# EAGLE design tiny13_charlie4_50mm_coincell_optical_diag (EAGLE 6.2)
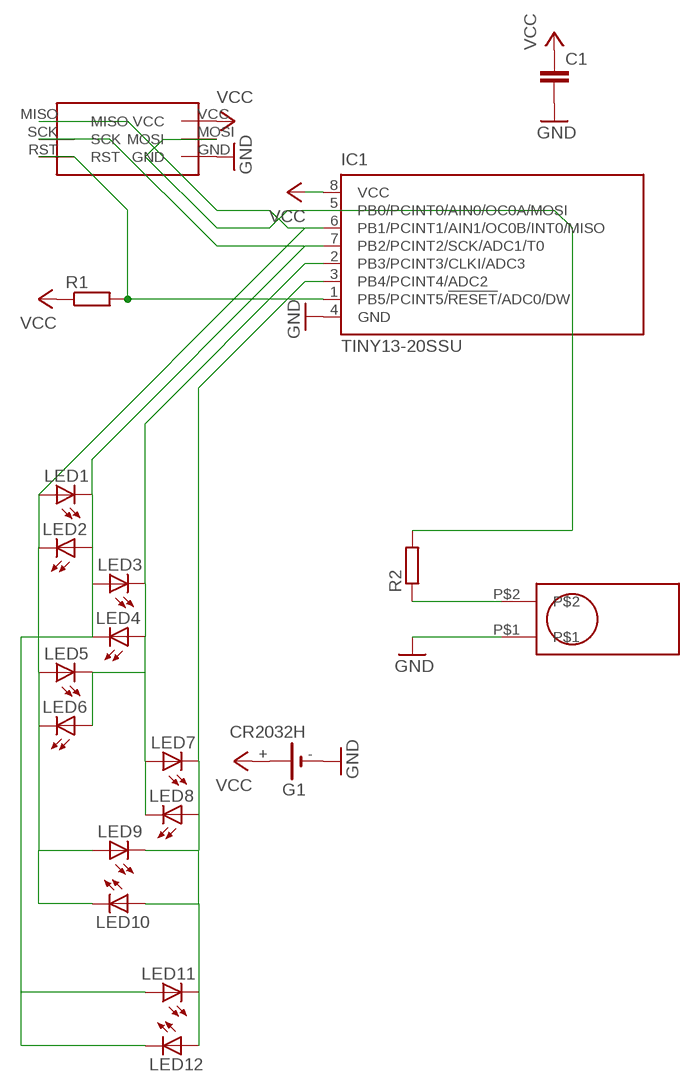
[diagram p0: schematic, sheet 1]

## Parts
C1  C-EU025-025X050  [C025-025X050]
G1  CR2032H  [CR2032H]
IC1  TINY13-20SSU  [8S1]
LED1  LED3MM  [LED3MM]
LED2  LED3MM  [LED3MM]
LED3  LED3MM  [LED3MM]
LED4  LED3MM  [LED3MM]
LED5  LED3MM  [LED3MM]
LED6  LED3MM  [LED3MM]
LED7  LED3MM  [LED3MM]
LED8  LED3MM  [LED3MM]
LED9  LED3MM  [LED3MM]
LED10  LED3MM  [LED3MM]
LED11  LED3MM  [LED3MM]
LED12  LED3MM  [LED3MM]
R1  R-EU_0204/5  [0204/5]
R2  R-EU_0204/5  [0204/5]
U$1  TILT_SWITCH_MECHANICAL  [TILT_SWITCH_MECHANICAL]
U$2  AVR_ISP_6_PIN_1X6_SMT_CONTACT_BIG  [CONTACT_ISP_PROGRAMMER_1X6_ATMEL]

## Nets
GND: C1.2 G1.- IC1.4(GND) U$1.P$1 U$2.GND
N$1: IC1.2(PB3/PCINT3/CLKI/ADC3) LED3.K(C) LED4.A LED5.K(C) LED6.A LED7.A LED8.K(C)
N$2: IC1.7(PB2/PCINT2/SCK/ADC1/T0) LED1.K(C) LED2.A LED3.A LED4.K(C) LED11.A LED12.K(C) U$2.SCK
N$3: R2.1 U$1.P$2
N$4: IC1.3(PB4/PCINT4/ADC2) LED7.K(C) LED8.A LED9.K(C) LED10.A LED11.K(C) LED12.A
N$5: IC1.5(PB0/PCINT0/AIN0/OC0A/MOSI) R2.2 U$2.MOSI
N$6: IC1.1(PB5/PCINT5/!RESET!/ADC0/DW) R1.2 U$2.RST
N$8: IC1.6(PB1/PCINT1/AIN1/OC0B/INT0/MISO) LED1.A LED2.K(C) LED5.A LED6.K(C) LED9.A LED10.K(C) U$2.MISO
VCC: C1.1 G1.+ IC1.8(VCC) R1.1 U$2.VCC
Unconnected: G1.+@1(+)

## Library data of the parts
C1 = resistor:C-EU: CAPACITOR, European symbol
G1 = battery:CR2032H: LI BATTERY Varta
IC1 = atmel:TINY13: 8-bit AVR Microcontroller with 1K Bytes In-System Programmable Flash Source: http://www.atmel.com/dyn/resources/prod_documents/2535S.pdf; MPN: ATTINY13-20SSU; OC_FARNELL: 1455133; OC_NEWARK: 58M3771
LED1-LED12 = 0-svo:LED: LED OSRAM: - CHIPLED LG R971, LG N971, LY N971, LG Q971, LY Q971, LO R971, LY R971 LH N974, LH R974 LS Q976, LO Q976, LY Q976 LO Q996 - Hyper CHIPLED LW Q18S LB Q993, LB Q99A, LB R99A - SideLED LS A670, LO A670, LY A670, LG A670, LP A670 LB A673, LV A673, LT A673, LW A673 LH A674 LY A675 LS A676, LA A676, LO A676, LY A676, LW A676 LS A679, LY A679, LG A679 - Hyper Micro SIDELED® LS Y876, LA Y876, LO Y876, LY Y876 LT Y87S - SmartLED LW L88C, LW L88S LB L89C, LB L89S, LG L890 LS L89K, LO L89K, LY L89K LS L896, LA L896, LO L896, LY L896 - TOPLED LS T670, LO T670, LY T670, LG T670, LP T670 LSG T670, LSP T670, LSY T670, LOP T670, LYG T670 LG T671, LOG T671, LSG T671 LB T673, LV T673, LT T673, LW T673 LH T674 LS T676, LA T676, LO T676, LY T676, LB T676, LH T676, LSB T676, LW T676 LB T67C, LV T67C, LT T67C, LS T67K, LO T67K, LY T67K, LW E67C LS E67B, LA E67B, LO E67B, LY E67B, LB E67C, LV E67C, LT E67C LW T67C LS T679, LY T679, LG T679 LS T770, LO T770, LY T770, LG T770, LP T770 LB T773, LV T773, LT T773, LW T773 LH T774 LS E675, LA E675, LY E675, LS T675 LS T776, LA T776, LO T776, LY T776, LB T776 LHGB T686 LT T68C, LB T68C - Hyper Mini TOPLED® LB M676 - Mini TOPLED Santana® LG M470 LS M47K, LO M47K, LY M47K Source: http://www.osram.convergy.de/
R1 R2 = resistor:R-EU_: RESISTOR, European symbol
U$1 = Mrule:TILT_SWITCH_MECHANICAL
U$2 = Mrule:AVR_ISP_6_PIN_1X6_SMT_CONTACT_BIG

## Board
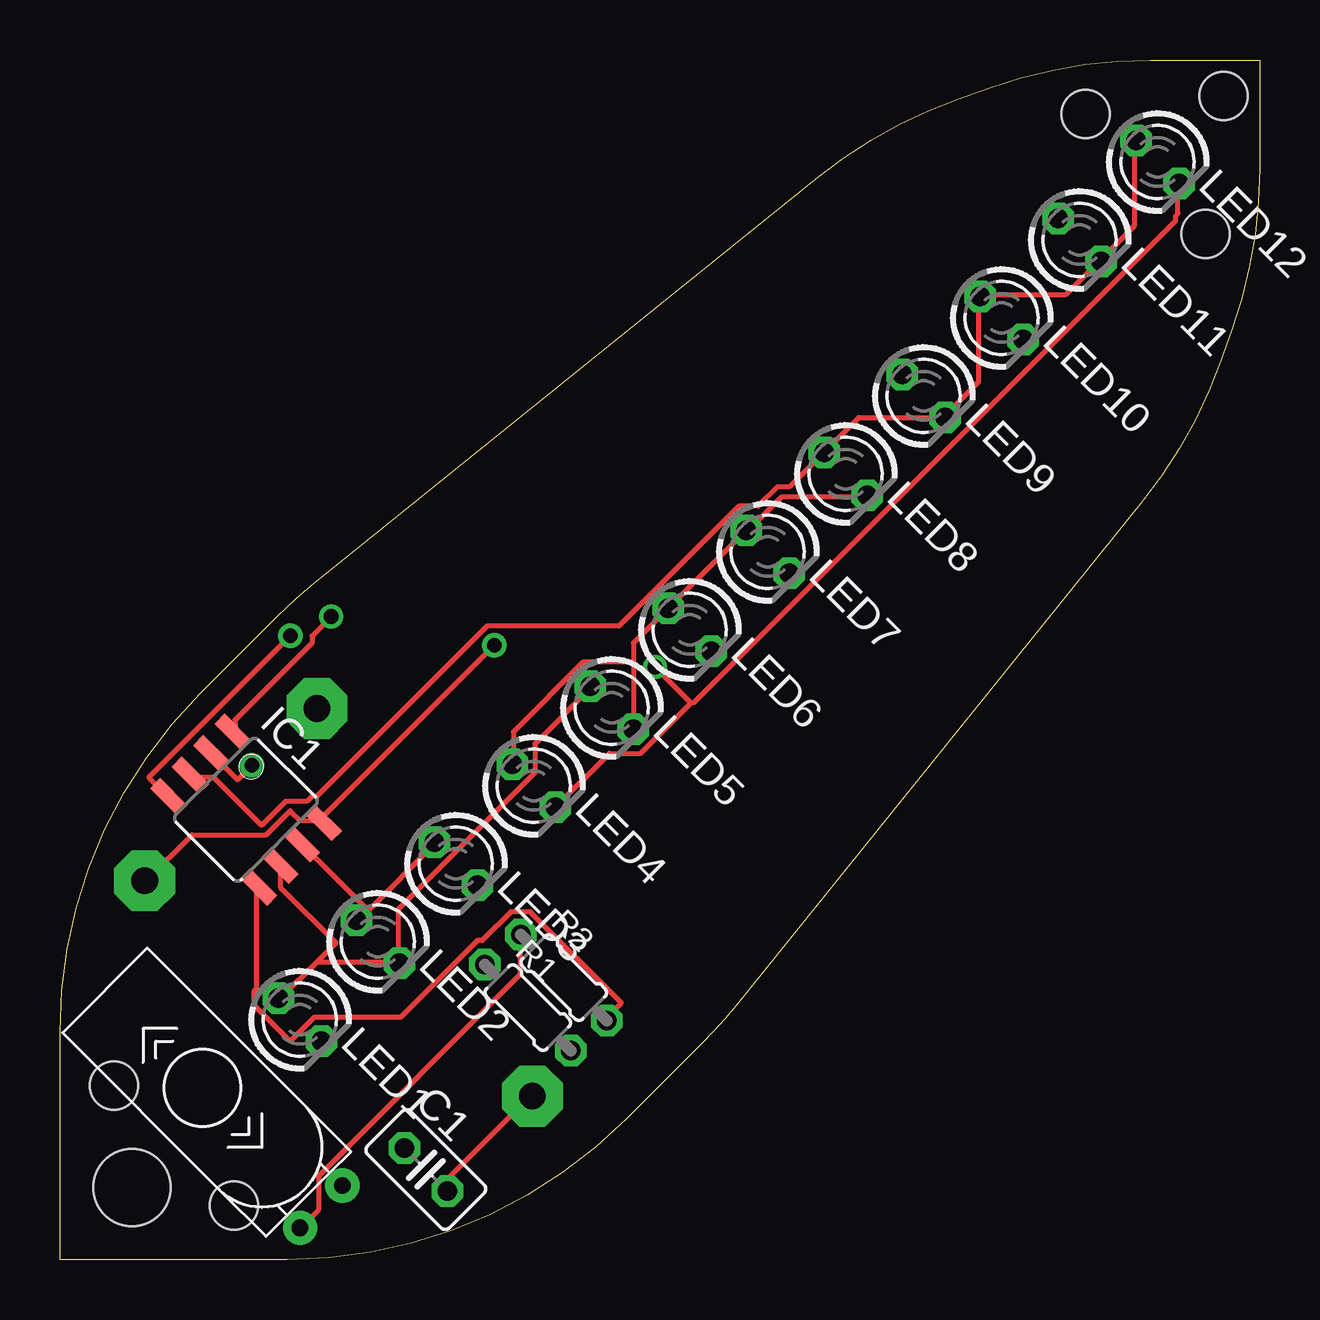
[diagram p1: board, top side]
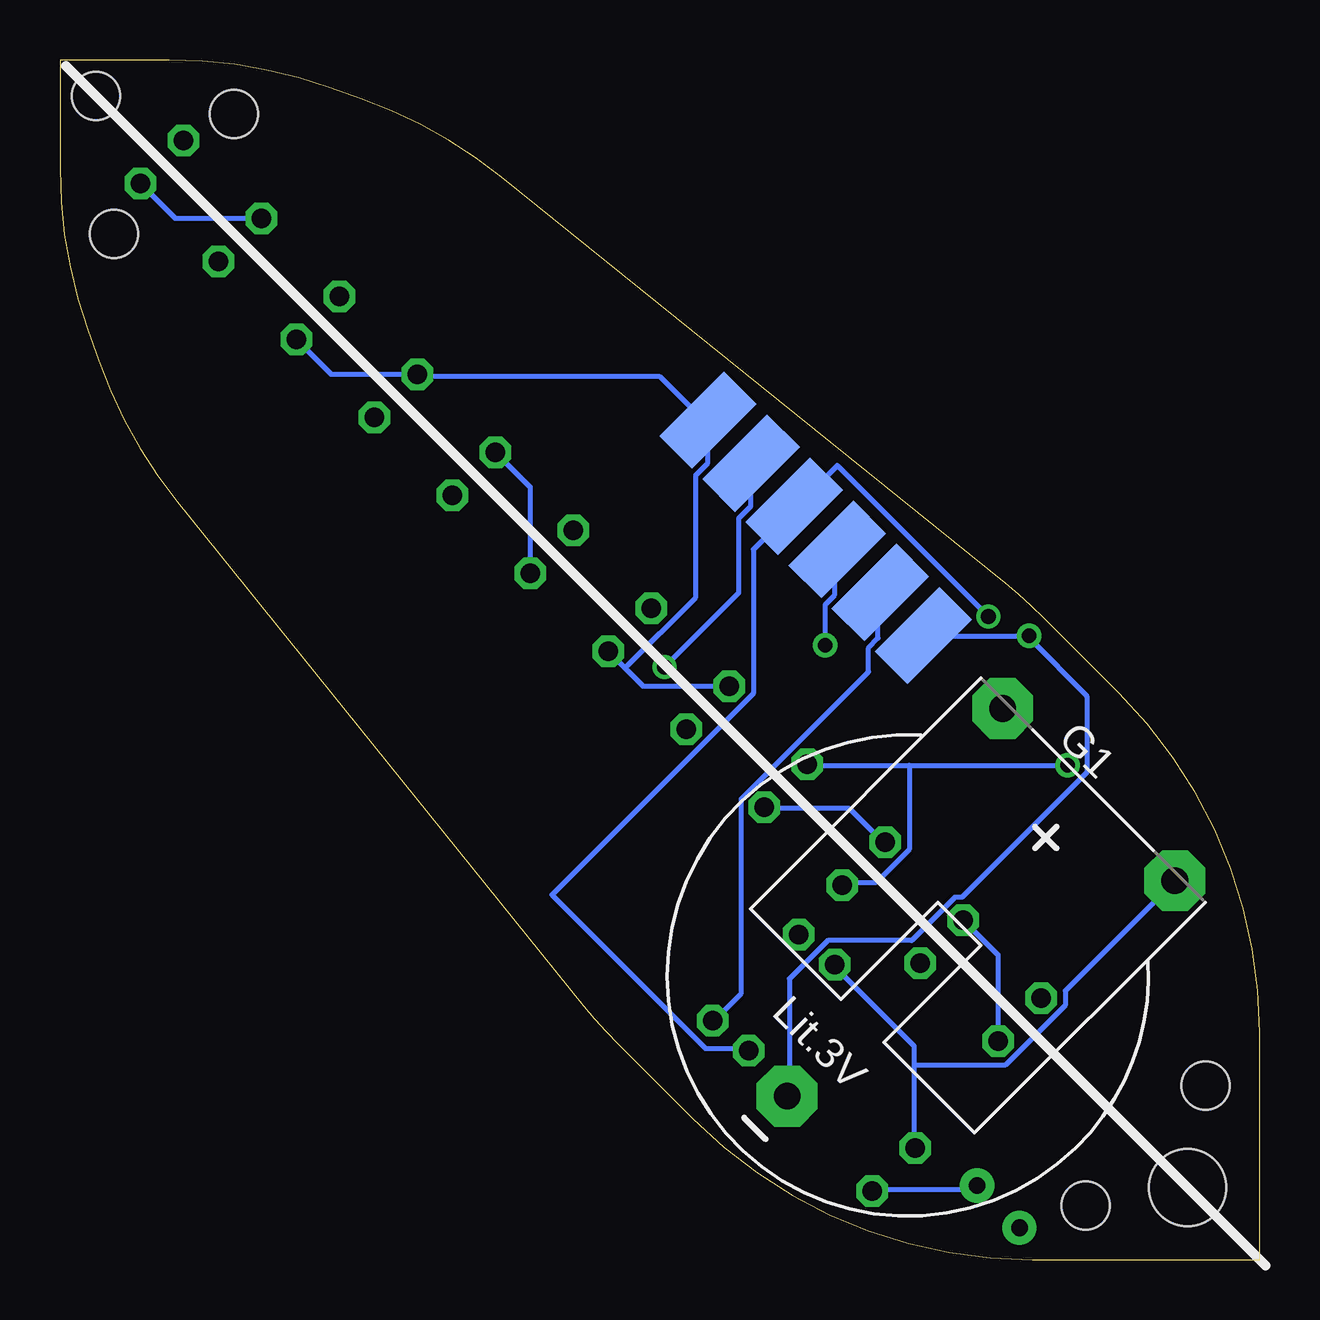
[diagram p2: board, bottom side, seen from below]

Size 50 x 50 mm. Coordinates in mm from the lower left corner, seen from the top.
Outline: 5.86,23.61 8.99,26.74 arc-6 10.58,28.17 31.6,45.11 arc-19 37.46,48.39 38.76,48.85 arc-20 45.44,50 50,50 50,45.44 arc-20 48.85,38.76 48.39,37.46 arc-19 45.11,31.6 28.17,10.58 arc-6 26.74,8.99 23.61,5.86 arc-45 9.47,0 0,0 0,9.47 arc-45 5.86,23.61
Copper layers (1*16): Top 0.035mm / dielectric 1.5mm / Bottom 0.035mm
Design rules: minimum track width 8mil, minimum drill 24mil, track to track 6mil, track to pad 6mil, pad to pad 6mil, via to via 6mil, smd to smd 0mil, copper to edge 10mil, drill to drill 8mil, minimum pad ring 10mil, minimum via ring 8mil, stop-mask expansion 4mil, vias tented up to drill 0mil, thermal gap 10mil
Holes 2 mm at 42.75,47.75 47.75,42.75 7.25,2.25 2.25,7.25 48.5,48.5
Holes 3.2 mm at 3,3

### Footprints (pad centres in the part's own frame; a part is rotated, then mirrored left to right if it is on the bottom)
C025-025X050 = drill 0.813 octagon: 1 -1.27,0; 2 1.27,0
CR2032H = drill 1.118 pad 2.54 octagon: + 5.08,10.795; +@1 -5.08,10.795; - 0,-6.985
8S1 = smd 0.6 x 1.6: 1 -1.905,-2.654; 2 -0.645,-2.654; 3 0.625,-2.654; 4 1.895,-2.654; 5 1.905,2.654; 6 0.635,2.654; 7 -0.635,2.654; 8 -1.905,2.654
LED3MM = drill 0.813 octagon: A -1.27,0; K 1.27,0
0204/5 = drill 0.813 octagon: 1 -2.54,0; 2 2.54,0
TILT_SWITCH_MECHANICAL = drill 0.7 pad 1.422: P$1 -0.75,1.25; P$2 -0.75,3.75
CONTACT_ISP_PROGRAMMER_1X6_ATMEL = smd 1.93 x 3.81: GND 6.35,0; MISO -6.35,0; MOSI 3.81,0; RST -1.27,0; SCK -3.81,0; VCC 1.27,0

### Placement (x,y rotation side)
C1  15.25,3.75 315 top
G1  14.75,11.75 315 bottom
IC1  7.75,18.75 225 top
LED1  10,10 315 top
LED2  13.25,13.25 315 top
LED3  16.5,16.5 315 top
LED4  19.75,19.75 315 top
LED5  23,23 315 top
LED6  26.25,26.25 315 top
LED7  29.5,29.5 315 top
LED8  32.75,32.75 315 top
LED9  36,36 315 top
LED10  39.25,39.25 315 top
LED11  42.5,42.5 315 top
LED12  45.75,45.75 315 top
R1  19.5,10.5 315 top
R2  21,11.75 315 top
U$1  12.12,4.5 135 top
U$2  18.5,30.5 315 bottom

### Tracks (layer width: path | path; a pad name or v marks a point on that pad's centre or on a via)
GND  (via drill 0.61)
  Top 0.203: C1.2 16.2,2.9 16.2,3.4 19.6,6.8 G1.- | v9.6,26 3.7,20.1 4.5,19.3 IC1.4
  Bottom 0.203: C1.2 16.1,2.9 11.9,2.9 11.8,3 U$1.P$1 | U$2.GND v9.6,26 9.6,25.9 7.2,23.5 7.2,20.3 12.4,15.1 12.7,15.1 14.5,13.3 18,13.3 19.6,11.7 19.6,6.9 G1.-
N$1  (via drill 0.61)
  Top 0.203: v8,20.6 7.4,20 6.4,21 IC1.2 | 23.9,24.9 23.9,25.7 25.3,27.1 LED6.A 25.4,27.2 28.5,30.3 28.6,30.3 LED7.A 28.7,30.4 30.1,31.8 33.6,31.8 LED8.K | 23.9,24.9 23.9,22.2 LED5.K | 23.9,24.9 21.8,24.9 18.9,22 18.9,20.7 LED4.A
  Bottom 0.203: 14.6,20.6 18.8,20.6 LED4.A | 14.6,20.6 v8,20.6 | 14.6,20.6 14.6,17.1 16,15.7 17.3,15.7 LED3.K
N$2  (via drill 0.61)
  Top 0.203: 12.8,14.6 10.1,17.3 IC1.7 | 12.8,14.6 12.4,14.2 LED2.A | LED3.A 15.6,17.3 12.9,14.6 12.8,14.6 | 26.3,23.2 v24.8,24.7 | 26.3,23.2 24.2,21.1 22.9,21.1 20.7,18.9 LED4.K | LED12.K 46.6,44.8 46.6,43.6 46.5,43.5 46.5,43.3 26.4,23.2 26.3,23.2
  Bottom 0.203: LED11.A 41.7,43.4 45.2,43.4 46.6,44.8 LED12.K | LED1.K 10.9,9.2 10.9,12.7 12.3,14.1 LED2.A | LED4.K 20.6,18.8 17.1,18.8 15.7,17.4 LED3.A | v24.8,24.7 21.7,27.8 21.7,30.9 21.2,31.4 21.2,33.1 U$2.SCK
N$3
  Top 0.203: R2.1 19.2,13.5 19.2,11.9 10.8,3.5 10.8,2.1 10.1,1.4 U$1.P$2
N$4
  Top 0.203: LED12.A 44.8,46.6 44.8,43.1 43.4,41.7 LED11.K 43.3,41.6 41.9,40.2 38.4,40.2 LED10.A 38.3,40.1 38.3,36.6 36.9,35.2 LED9.K 36.8,35.1 33.3,35.1 31.9,33.7 LED8.A 31.8,33.6 30.4,32.2 29.9,32.2 29.1,31.4 28.3,31.4 23.3,26.4 17.8,26.4 10.7,19.3 10.5,19.3 10.3,19.1 9.4,19.1 8.4,18.1 6.4,20.1 5.5,20.1 IC1.3
  Bottom 0.203: LED7.K 30.4,28.7 30.4,32.2 31.8,33.6 LED8.A
N$5
  Top 0.203: IC1.5 8.2,15.5 8.2,11.3 8.1,11.2 8.1,10.6 9.6,9.1 10.6,10.1 14.2,10.1 17.4,13.3 17.6,13.3 18.8,14.5 19.6,14.5 23.4,10.7 22.7,10 R2.2
  Bottom 0.203: U$2.MOSI 15.9,27.8 15.9,25.9 16.3,25.5 16.3,24.5 21.6,19.2 21.6,11.1 22.7,10 R2.2
N$6  (via drill 0.61)
  Top 0.203: v11.3,26.8 10.5,26 10.5,25.7 7.3,22.5 7.3,22 IC1.1
  Bottom 0.203: v11.3,26.8 17.6,33.1 19.3,31.4 U$2.RST 19.4,31.3 21.1,29.6 21.1,23.6 29.5,15.2 23.1,8.8 21.3,8.8 R1.2
N$8
  Top 0.203: 10.75,12.45 9.2,10.9 LED1.A | 10.75,12.45 11.5,13.2 9.2,15.5 9.2,16.4 IC1.6 | 10.75,12.45 10.8,12.4 14.1,12.4 LED2.K 14.1,12.5 14.1,14.6 19.8,20.3 19.8,21.5 22.1,23.8 LED5.A
  Bottom 0.203: LED10.K 40.1,38.3 38.7,36.9 35.2,36.9 LED9.A 35.1,36.8 25,36.8 23.1,34.9 U$2.MISO 23,34.9 23,33.2 23.5,32.7 23.5,27.6 26.45,24.65 | 26.45,24.65 27.1,25.3 LED6.K | 26.45,24.65 25.7,23.9 22.2,23.9 LED5.A
VCC  (via drill 0.61)
  Top 0.203: G1.+ 3.6,15.8 5.5,17.7 8.6,17.7 9.6,18.7 10,18.3 10.9,18.3 IC1.8 10.9,18.4 v18.1,25.6
  Bottom 0.203: 14.4,8.1 14.4,8.9 17.7,12.2 R1.1 | 14.4,8.1 14.4,4.7 C1.1 | v18.1,25.6 18.1,27.3 17.7,27.7 17.7,29.6 U$2.VCC | 14.4,8.1 10.6,8.1 8.1,10.6 8.1,11.2 3.6,15.7 G1.+